# EAGLE design uart_pc (EAGLE 8.3.0)

## Sheet 1 of 4
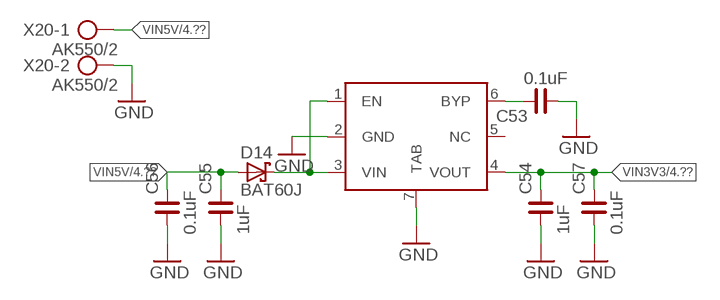
[diagram p0: schematic, sheet 1]

### Parts
C53  0.1uF  C_0603  [C0603]
C54  1uF  C_0603  [C0603]
C55  1uF  C_0603  [C0603]
C56  0.1uF  C_0603  [C0603]
C57  0.1uF  C_0603  [C0603]
D14  BAT60J  [SOD323_ST]
U$3  MIC5353-3.3YMT-TR  [DFN-6_DC-L]
X20  AK550/2  [AK550/2]

### Nets
GND: C53.1 C54.1 C55.1 C56.1 C57.1 U$3.2(GND) U$3.7(TAB) X20.2 ; also sheet 2,3,4
N$47: D14.C U$3.1(EN) U$3.3(VIN)
N$51: C53.2 U$3.6(BYP)
VIN3V3: C54.2 C57.2 U$3.4(VOUT) ; also sheet 4
VIN5V: C55.2 C56.2 D14.A X20.1 ; also sheet 4
Unconnected: U$3.5(NC)

## Sheet 2 of 4
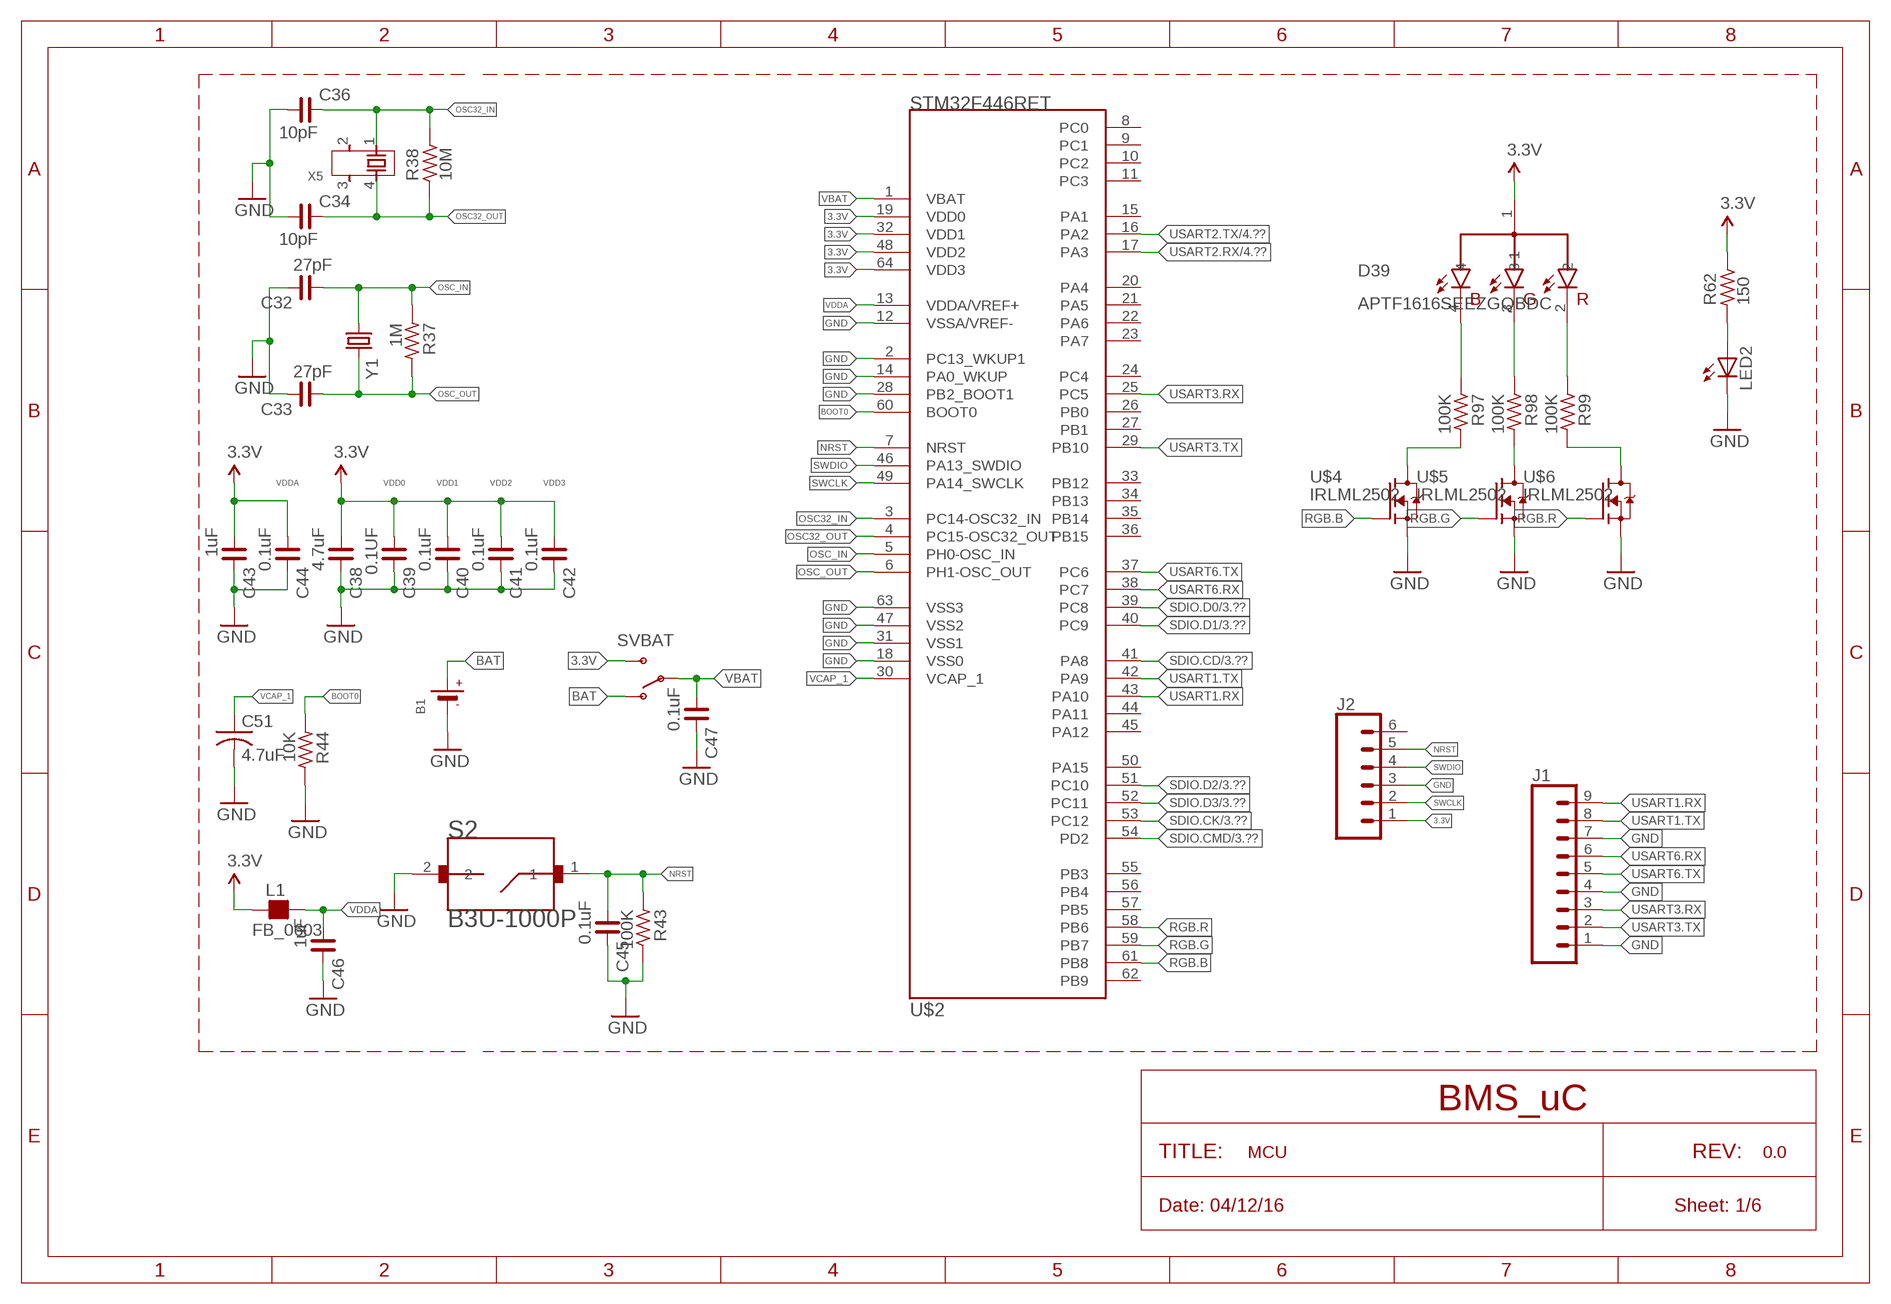
[diagram p1: schematic, sheet 2]

### Parts
B1  BATTERYCR1220_SMT  [CR1220]
C32  27pF  C_0603  [C0603]
C33  27pF  C_0603  [C0603]
C34  10pF  C_0603  [C0603]
C36  10pF  C_0603  [C0603]
C38  4.7uF  C_0603  [C0603]
C39  0.1UF  C_0603  [C0603]
C40  0.1uF  C_0603  [C0603]
C41  0.1uF  C_0603  [C0603]
C42  0.1uF  C_0603  [C0603]
C43  1uF  C_0603  [C0603]
C44  0.1uF  C_0603  [C0603]
C45  0.1uF  C_0603  [C0603]
C46  1uF  C_0603  [C0603]
C47  0.1uF  C_0603  [C0603]
C51  4.7uF  C-USC1206  [C1206]
D39  APTF1616SEEZGQBDC  [0606(1616)]
J1  CONN_09  [1X09]
J2  CONN_06SILK_FEMALE_PTH  [1X06]
L1  FB_0603  [L0603]
LED2  LEDCHIP-LED0603  [CHIP-LED0603]
R37  1M  R_0603  [R0603]
R38  10M  R_0603  [R0603]
R43  100K  R_0603  [R0603]
R44  10K  R_0603  [R0603]
R62  150  R_0603  [R0603]
R97  100K  R_0603  [R0603]
R98  100K  R_0603  [R0603]
R99  100K  R_0603  [R0603]
S2  B3U-1000P  [SW_B3U-1000P]
SVBAT  SWITCH-SPDTSMD  [AYZ0202]
U$2  STM32F446RET  [LQFP64]
U$4  IRLML2502  [SOT23]
U$5  IRLML2502  [SOT23]
U$6  IRLML2502  [SOT23]
X5  CRYSTAL-4PIN  [ABRACON-ABS25-32.768KHZ]
Y1  CRYSTALSMD  [HC49UP]

### Nets
3.3V: C38.1 C39.1 C40.1 C41.1 C42.1 C43.1 C44.1 D39.1 J2.1 L1.1 R62.2 SVBAT.3(S) U$2.19(VDD0) U$2.32(VDD1) U$2.48(VDD2) U$2.64(VDD3) ; also sheet 3,4
BAT: B1.+$1(+) SVBAT.1(O)
BOOT0: R44.1 U$2.60(BOOT0)
GND: B1.- C32.2 C33.2 C34.1 C36.1 C38.2 C39.2 C40.2 C41.2 C42.2 C43.2 C44.2 C45.2 C46.2 C47.2 C51.2 J1.1 J1.4 J1.7 J2.3 LED2.C R43.2 R44.2 S2.2 U$2.2(PC13_WKUP1) U$2.12(VSSA/VREF-) U$2.14(PA0_WKUP) U$2.18(VSS0) U$2.28(PB2_BOOT1) U$2.31(VSS1) U$2.47(VSS2) U$2.63(VSS3) U$4.2(S) U$5.2(S) U$6.2(S) ; also sheet 1,3,4
N$11: D39.3 R98.1
N$12: D39.2 R99.1
N$49: LED2.A R62.1
N$108: D39.4 R97.1
N$117: R97.2 U$4.3(D)
N$122: R98.2 U$5.3(D)
N$126: R99.2 U$6.3(D)
NRST: C45.1 J2.5 R43.1 S2.1 U$2.7(NRST)
OSC32_IN: C36.2 R38.2 U$2.3(PC14-OSC32_IN) X5.1
OSC32_OUT: C34.2 R38.1 U$2.4(PC15-OSC32_OUT) X5.4
OSC_IN: C32.1 R37.1 U$2.5(PH0-OSC_IN) Y1.1
OSC_OUT: C33.1 R37.2 U$2.6(PH1-OSC_OUT) Y1.2
RGB.B: U$2.61(PB8) U$4.1(G)
RGB.G: U$2.59(PB7) U$5.1(G)
RGB.R: U$2.58(PB6) U$6.1(G)
SDIO.CD: U$2.41(PA8) ; also sheet 3
SDIO.CK: U$2.53(PC12) ; also sheet 3
SDIO.CMD: U$2.54(PD2) ; also sheet 3
SDIO.D0: U$2.39(PC8) ; also sheet 3
SDIO.D1: U$2.40(PC9) ; also sheet 3
SDIO.D2: U$2.51(PC10) ; also sheet 3
SDIO.D3: U$2.52(PC11) ; also sheet 3
SWCLK: J2.2 U$2.49(PA14_SWCLK)
SWDIO: J2.4 U$2.46(PA13_SWDIO)
USART1.RX: J1.9 U$2.43(PA10)
USART1.TX: J1.8 U$2.42(PA9)
USART2.RX: U$2.17(PA3) ; also sheet 4
USART2.TX: U$2.16(PA2) ; also sheet 4
USART3.RX: J1.3 U$2.25(PC5)
USART3.TX: J1.2 U$2.29(PB10)
USART6.RX: J1.6 U$2.38(PC7)
USART6.TX: J1.5 U$2.37(PC6)
VBAT: C47.1 SVBAT.2(P) U$2.1(VBAT)
VCAP_1: C51.1 U$2.30(VCAP_1)
VDDA: C46.1 L1.2 U$2.13(VDDA/VREF+)
Unconnected: J2.6 U$2.8(PC0) U$2.9(PC1) U$2.10(PC2) U$2.11(PC3) U$2.15(PA1) U$2.20(PA4) U$2.21(PA5) U$2.22(PA6) U$2.23(PA7) U$2.24(PC4) U$2.26(PB0) U$2.27(PB1) U$2.33(PB12) U$2.34(PB13) U$2.35(PB14) U$2.36(PB15) U$2.44(PA11) U$2.45(PA12) U$2.50(PA15) U$2.55(PB3) U$2.56(PB4) U$2.57(PB5) U$2.62(PB9) X5.2 X5.3

### Notes on the sheet
- VDDA | VDD0 | VDD1 | VDD2 | VDD3
- BMS_uC
- TITLE: | MCU | REV: | 0.0
- Date: 04/12/16 | Sheet: 1/6

## Sheet 3 of 4
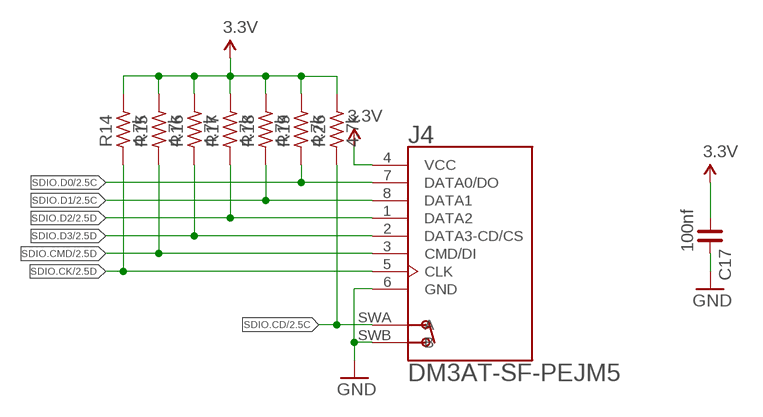
[diagram p2: schematic, sheet 3]

### Parts
C17  100nf  C_0603  [C0603]
J4  DM3AT-SF-PEJM5  [HRS_DM3AT-SF-PEJM5]
R14  4.7k  R_0603  [R0603]
R15  4.7k  R_0603  [R0603]
R16  4.7k  R_0603  [R0603]
R17  4.7k  R_0603  [R0603]
R18  4.7k  R_0603  [R0603]
R19  4.7k  R_0603  [R0603]
R26  4.7k  R_0603  [R0603]

### Nets
3.3V: C17.1 J4.4(VCC) R14.2 R15.2 R16.2 R17.2 R18.2 R19.2 R26.2 ; also sheet 2,4
GND: C17.2 J4.6(GND) J4.SWB(B) ; also sheet 1,2,4
SDIO.CD: J4.SWA(A) R26.1 ; also sheet 2
SDIO.CK: J4.5(CLK) R14.1 ; also sheet 2
SDIO.CMD: J4.3(CMD/DI) R15.1 ; also sheet 2
SDIO.D0: J4.7(DATA0/DO) R19.1 ; also sheet 2
SDIO.D1: J4.8(DATA1) R18.1 ; also sheet 2
SDIO.D2: J4.1(DATA2) R17.1 ; also sheet 2
SDIO.D3: J4.2(DATA3-CD/CS) R16.1 ; also sheet 2

## Sheet 4 of 4
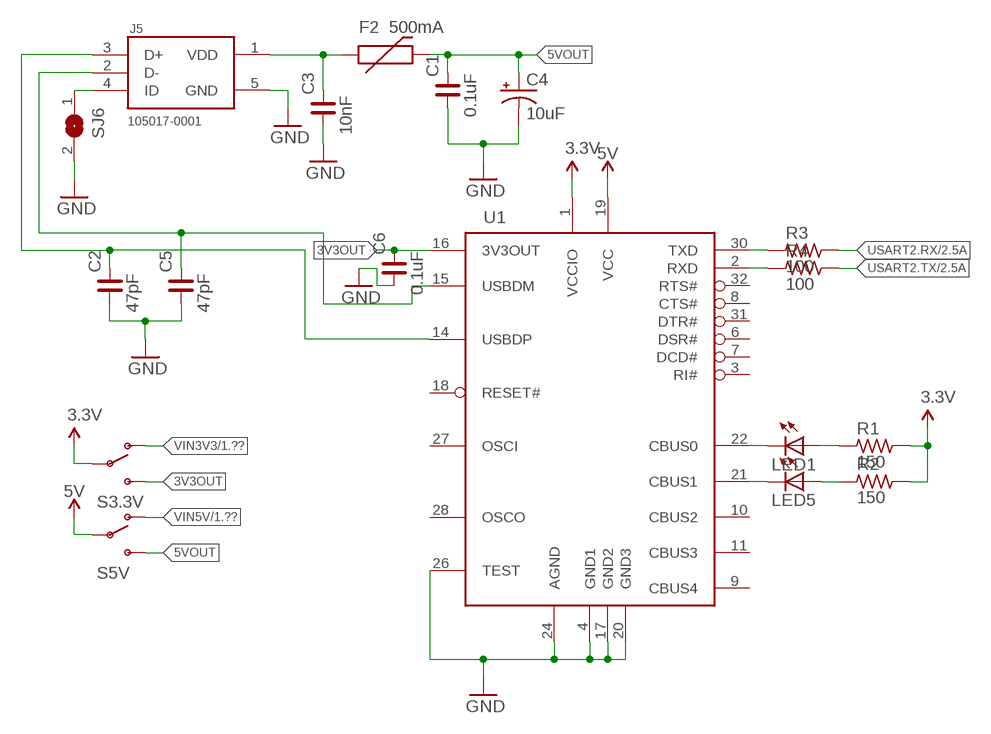
[diagram p3: schematic, sheet 4]

### Parts
C1  0.1uF  C_0603  [C0603]
C2  47pF  C_0603  [C0603]
C3  10nF  C_0603  [C0603]
C4  10uF  10UF-16V-10%(TANT)  [EIA3216]
C5  47pF  C_0603  [C0603]
C6  0.1uF  C_0603  [C0603]
F2  500mA  PTCSMD  [PTC-1206]
J5  105017-0001  [MOLEX_105017-0001]
LED1  LEDCHIPLED_0603  [CHIPLED_0603]
LED5  LEDCHIPLED_0603  [CHIPLED_0603]
R1  150  R_0603  [R0603]
R2  150  R_0603  [R0603]
R3  100  R_0603  [R0603]
R4  100  R_0603  [R0603]
S3.3V  SWITCH-SPDTSMD  [AYZ0202]
S5V  SWITCH-SPDTSMD  [AYZ0202]
SJ6  SOLDERJUMPER  [SOLDERJUMPER_ARROW_NOPASTE]
U1  FT232RQ  [LQFP32]

### Nets
3.3V: R1.2 R2.2 S3.3V.2(P) U1.1(VCCIO) ; also sheet 2,3
3V3OUT: C6.2 S3.3V.3(S) U1.16(3V3OUT)
5V: S5V.2(P) U1.19(VCC)
5VOUT: C1.2 C4.A(+) F2.2 S5V.3(S)
GND: C1.1 C2.1 C3.1 C4.C(-) C5.1 C6.1 J5.5(GND) SJ6.2 U1.4(GND1) U1.17(GND2) U1.20(GND3) U1.24(AGND) U1.26(TEST) ; also sheet 1,2,3
N$1: C5.2 J5.2(D-) U1.15(USBDM)
N$2: C2.2 J5.3(D+) U1.14(USBDP)
N$3: C3.2 F2.1 J5.1(VDD)
N$4: J5.4(ID) SJ6.1
N$5: LED1.C U1.22(CBUS0)
N$6: LED5.C U1.21(CBUS1)
N$7: LED1.A R1.1
N$8: LED5.A R2.1
N$9: R3.1 U1.30(TXD)
N$10: R4.1 U1.2(RXD)
USART2.RX: R3.2 ; also sheet 2
USART2.TX: R4.2 ; also sheet 2
VIN3V3: S3.3V.1(O) ; also sheet 1
VIN5V: S5V.1(O) ; also sheet 1
Unconnected: U1.3(RI#) U1.6(DSR#) U1.7(DCD#) U1.8(CTS#) U1.9(CBUS4) U1.10(CBUS2) U1.11(CBUS3) U1.18(RESET#) U1.27(OSCI) U1.28(OSCO) U1.31(DTR#) U1.32(RTS#)

## Library data of the parts
B1 = microbuilder:BATTERY: CR1220 SMT - Digikey: 3001K-ND CD2032 BAT-HLD-001 - Digikey: BAT-HLD-001-ND
C1-C3 C5 C6 C17 C32-C34 C36 C38-C47 C53-C57 = rc-master-smd:C_: NON-POLARIZED CAP
C4 = SparkFun-Capacitors:10UF-16V-10%(TANT): CAP-00811 1206/EIA-3216 Tantalum capacitor; PROD_ID: CAP-00811
C51 = rcl:C-US: CAPACITOR, American symbol
D14 = diode:BAT60J: Schottky barrier diode Source: www.st.com, BAT60J.pdf
D39 = Kingbright:APTF1616SEEZGQBDC: Red/Green/Blue 0404 120° Water Clear 30/40/20 mcd PCB Surface Mount LED; AVAILABILITY: Good; DESCRIPTION: Red/Green/Blue 0404 120%C2%B0 Water Clear 30/40/20 mcd PCB Surface Mount LED; MF: Lumex; MP: SML-LX0404SIUPGUSB; PACKAGE: 0404 Lumex; PRICE: 0.57 USD
F2 = SparkFun:PTC: Resettable Fuse PTC Resettable Fuse. Spark Fun Electronics SKU : COM-08357
J1 = SparkFun-Connectors:CONN_09: Multi connection point. Often used as Generic Header-pin footprint for 0.1 inch spaced/style header connections On any of the 0.1 inch spaced packages, you can populate with these: Break Away Headers - Straight <https://www.sparkfun.com/products/116> (PRT-00116) Break Away Male Headers - Right Angle <https://www.sparkfun.com/products/553> (PRT-00553) Female Headers <https://www.sparkfun.com/products/115> (PRT-00115) Break Away Headers - Machine Pin <https://www.sparkfun.com/products/117> (PRT-00117) Break Away Female Headers - Swiss Machine Pin <https://www.sparkfun.com/products/743> (PRT-00743) For SCREWTERMINALS and SPRING TERMINALS visit here: Screw Terimnals on SparkFun.com <https://www.sparkfun.com/search/results?term=Screw+Terminals> (5mm/3.5mm/2.54mm spacing) This device is also useful as a general connection point to wire up your design to another part of your project. Our various solder wires solder well into these plated through hole pads. Hook-Up Wire - Assortment (Stranded, 22 AWG) <https://www.sparkfun.com/products/11375> (PRT-11375) Hook-Up Wire - Assortment (Solid Core, 22 AWG) <https://www.sparkfun.com/products/11367> (PRT-11367) View the entire wire category on our website here <https://www.sparkfun.com/categories/141> Special notes: Molex polarized connector foot print use with SKU : PRT-08231 with associated crimp pins and housings. 1MM SMD Version SKU: PRT-10208 NOTES ON THE VARIANTS LOCK and LOCK_LONGPADS... This footprint was designed to help hold the alignment of a through-hole component (i.e. 6-pin header) while soldering it into place. You may notice that each hole has been shifted either up or down by 0.005 of an inch from it's more standard position (which is a perfectly straight line). This slight alteration caused the pins (the squares in the middle) to touch the edges of the holes. Because they are alternating, it causes a "brace" to hold the component in place. 0.005 has proven to be the perfect amount of "off-center" position when using our standard breakaway headers. Although looks a little odd when you look at the bare footprint, once you have a header in there, the alteration is very hard to notice. Also,if you push a header all the way into place, it is covered up entirely on the bottom side.
J2 = SparkFun-Connectors:CONN_06: Multi connection point. Often used as Generic Header-pin footprint for 0.1 inch spaced/style header connections On any of the 0.1 inch spaced packages, you can populate with these: Break Away Headers - Straight <https://www.sparkfun.com/products/116> (PRT-00116) Break Away Male Headers - Right Angle <https://www.sparkfun.com/products/553> (PRT-00553) Female Headers <https://www.sparkfun.com/products/115> (PRT-00115) Break Away Headers - Machine Pin <https://www.sparkfun.com/products/117> (PRT-00117) Break Away Female Headers - Swiss Machine Pin <https://www.sparkfun.com/products/743> (PRT-00743) Arduino Stackable Header - 6 Pin <https://www.sparkfun.com/products/9280> (PRT-09280) For SCREWTERMINALS and SPRING TERMINALS visit here: Screw Terimnals on SparkFun.com <https://www.sparkfun.com/search/results?term=Screw+Terminals> (5mm/3.5mm/2.54mm spacing) This device is also useful as a general connection point to wire up your design to another part of your project. Our various solder wires solder well into these plated through hole pads. Hook-Up Wire - Assortment (Stranded, 22 AWG) <https://www.sparkfun.com/products/11375> (PRT-11375) Hook-Up Wire - Assortment (Solid Core, 22 AWG) <https://www.sparkfun.com/products/11367> (PRT-11367) View the entire wire category on our website here <https://www.sparkfun.com/categories/141>; PROD_ID: CONN-08437
J4 = DM3AT-SF-PEJM5:DM3AT-SF-PEJM5: DM3 Series 8 Position Right Angle SMT Push Push Ejection MicroSD Card Connector; AVAILABILITY: Good; DESCRIPTION: DM3 Series 8 Position Right Angle SMT Push Push Ejection MicroSD Card Connector; MF: Hirose; MP: DM3AT-SF-PEJM5; PACKAGE: None; PRICE: 1.95 USD
J5 = Molex_105017-0001:105017-0001; AVAILABILITY: Good; DESCRIPTION: Conn USB Type B M 5 POS 0.65mm Solder RA Thru-Hole 5 Terminal 1 Port Embossed T/R; MF: Molex; MP: 105017-0001; PACKAGE: None; PRICE: 0.52 USD
L1 = rc-master-smd:FB_: FERRITE BEAD
LED1 LED2 LED5 = adafruit:LED: LED OSRAM: - CHIPLED LG R971, LG N971, LY N971, LG Q971, LY Q971, LO R971, LY R971 LH N974, LH R974 LS Q976, LO Q976, LY Q976 LO Q996 - Hyper CHIPLED LW Q18S LB Q993, LB Q99A, LB R99A - SideLED LS A670, LO A670, LY A670, LG A670, LP A670 LB A673, LV A673, LT A673, LW A673 LH A674 LY A675 LS A676, LA A676, LO A676, LY A676, LW A676 LS A679, LY A679, LG A679 - Hyper Micro SIDELED® LS Y876, LA Y876, LO Y876, LY Y876 LT Y87S - SmartLED LW L88C, LW L88S LB L89C, LB L89S, LG L890 LS L89K, LO L89K, LY L89K LS L896, LA L896, LO L896, LY L896 - TOPLED LS T670, LO T670, LY T670, LG T670, LP T670 LSG T670, LSP T670, LSY T670, LOP T670, LYG T670 LG T671, LOG T671, LSG T671 LB T673, LV T673, LT T673, LW T673 LH T674 LS T676, LA T676, LO T676, LY T676, LB T676, LH T676, LSB T676, LW T676 LB T67C, LV T67C, LT T67C, LS T67K, LO T67K, LY T67K, LW E67C LS E67B, LA E67B, LO E67B, LY E67B, LB E67C, LV E67C, LT E67C LW T67C LS T679, LY T679, LG T679 LS T770, LO T770, LY T770, LG T770, LP T770 LB T773, LV T773, LT T773, LW T773 LH T774 LS E675, LA E675, LY E675, LS T675 LS T776, LA T776, LO T776, LY T776, LB T776 LHGB T686 LT T68C, LB T68C - Hyper Mini TOPLED® LB M676 - Mini TOPLED Santana® LG M470 LS M47K, LO M47K, LY M47K Source: http://www.osram.convergy.de/
R1-R4 R14-R19 R26 R37 R38 R43 R44 R62 R97-R99 = rc-master-smd:R_: RESISTOR
S2 = B3U-1000P:B3U-1000P: Switch Tactile N.O. SPST Round Button Gull Wing 0.05A 12VDC 1.5N SMD Embossed T/R; AVAILABILITY: Good; DESCRIPTION: Switch Tactile N.O. SPST Round Button Gull Wing 0.05A 12VDC 1.5N SMD Embossed T/R; MF: Omron; MP: B3U-1000P; PACKAGE: None; PRICE: 0.72 USD
S3.3V S5V SVBAT = SparkFun-Electromechanical:SWITCH-SPDT: SPDT Switch Simple slide switch, Spark Fun Electronics SKU : COM-00102 DPDT SMT slide switch, AYZ0202, SWCH-08179; PROD_ID: SWCH-08179
SJ6 = microbuilder:SOLDERJUMPER: SMD Solder JUMPER Solder the two pads together to create a connection, or remove the solder to break it. REFLOW - Use this footprint for solder paste and reflow ovens. WAVE - Use this footprint for hand-soldering (larger pads). CLOSED - Has a trace between the two pads to ensure it is closed by default. The trace needs to be cut to disable the jumper, and can be closed again by creating a solder bridge between the two pads.; BOM: EXCLUDE
U1 = FT232RQ:FT232RQ: USB UART 4th Generation USB UART (USB <-> Serial) Controller; AVAILABILITY: Good; DESCRIPTION: USB-to-UART 1-CH 256Byte FIFO 5V 32-Pin QFN EP; MF: FTDI; MP: FT232RQ; PACKAGE: None; PRICE: 6.56 USD
U$2 = pel_stm32:STM32F446RET
U$3 = DFN-6_DC-L:MIC5353-3.3YMT-TR
U$4-U$6 = IRLML2502:IRLML2502; AVAILABILITY: Unavailable; MF: International Rectifier; MP: IRLML2502; PACKAGE: SOT-23-3 International Rectifier; PRICE: 0.17 USD
X5 = FaBo-Crystal:CRYSTAL-4PIN
X20 = con-ptr500:AK550/2: CONNECTOR; OC_FARNELL: unknown; OC_NEWARK: unknown
Y1 = SparkFun-FreqCtrl:CRYSTAL: Various standard crystals. Proven footprints.

## Net classes
0 default: width 0.203 mm

## Board
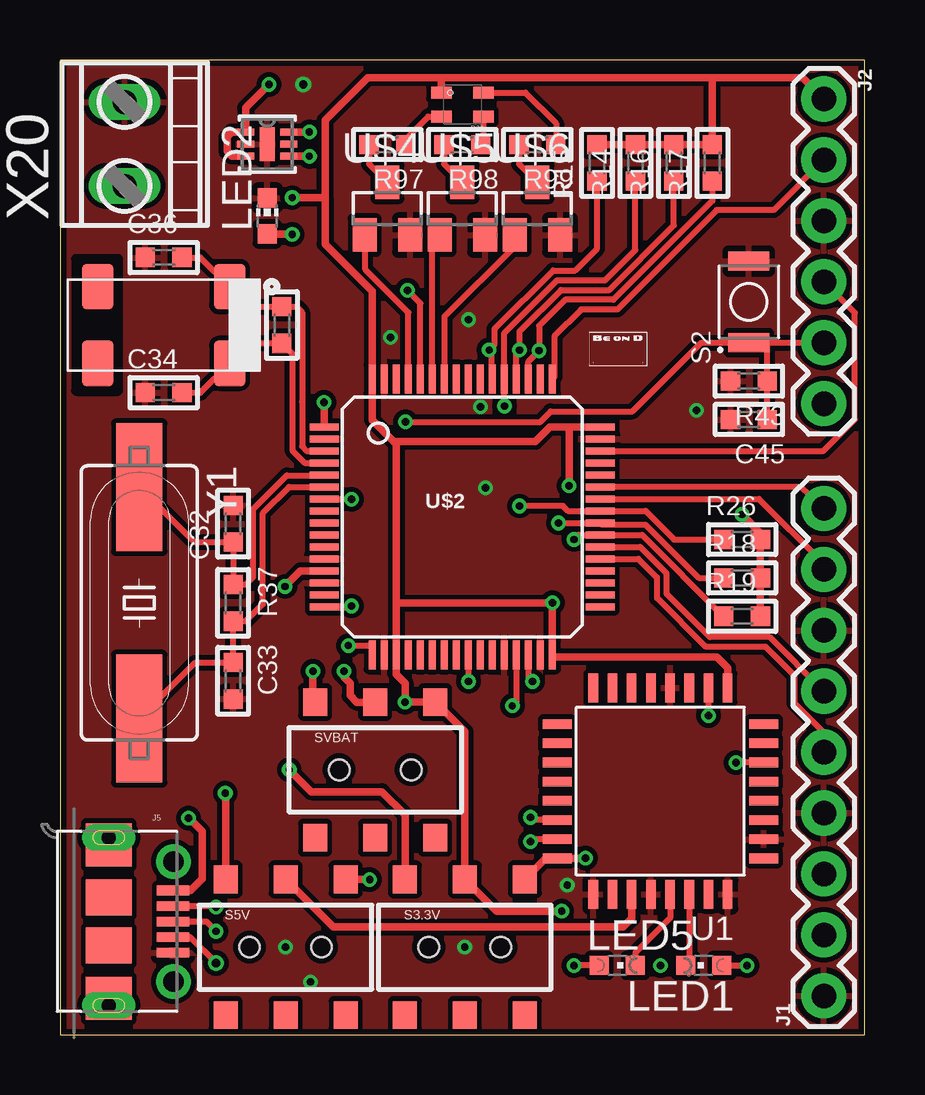
[diagram p4: board, top side]
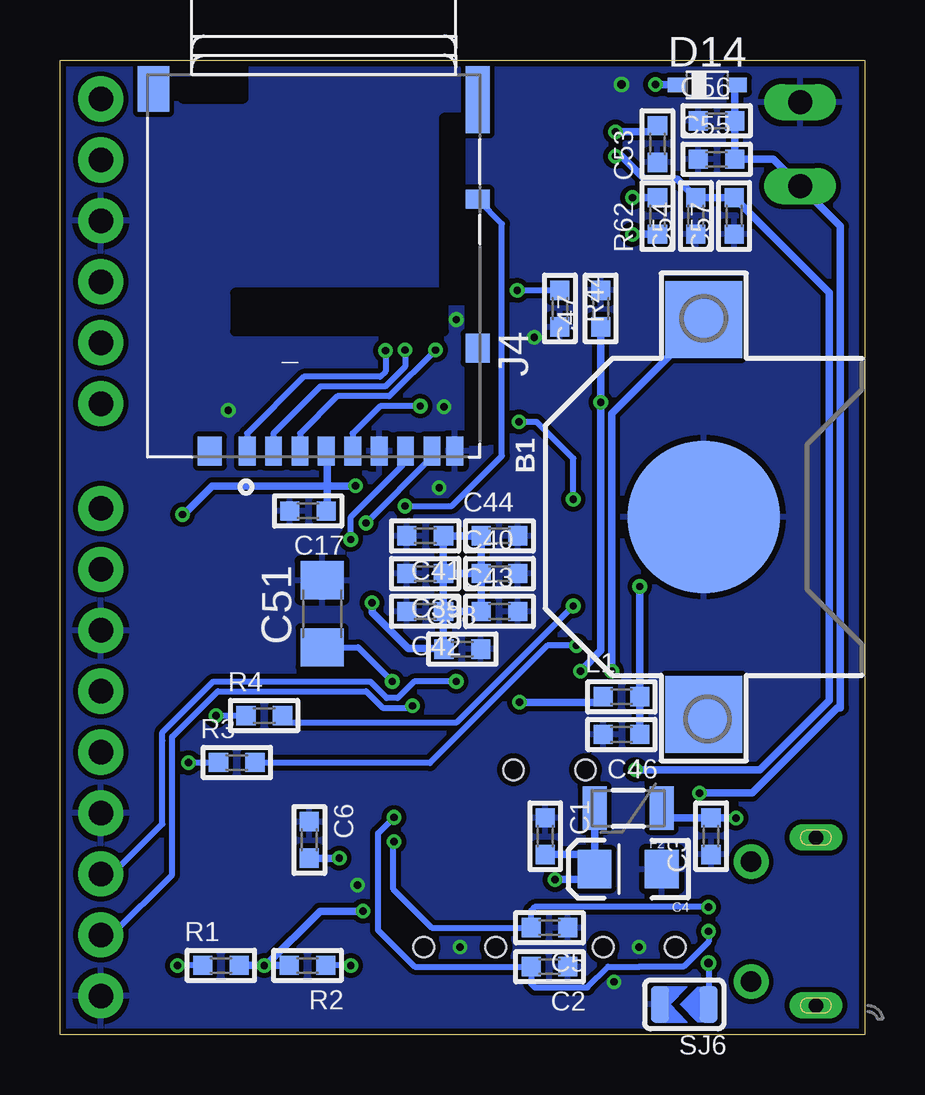
[diagram p5: board, bottom side, seen from below]

Size 33.53 x 40.64 mm. Coordinates in mm from the lower left corner, seen from the top.
Outline: 0,0 33.53,0 33.53,40.64 0,40.64 0,0
Copper layers (1*16): Top 0.035mm / dielectric 1.5mm / Bottom 0.035mm
Design rules "SeeedStudio_2layer_DRU_no_angle_20140221": minimum track width 6mil, minimum drill 12mil, track to track 6mil, track to pad 6mil, pad to pad 6mil, via to via 6mil, smd to smd 0mil, copper to edge 10mil, drill to drill 10mil, minimum pad ring 10mil, minimum via ring 6mil, stop-mask expansion 2mil, vias tented up to drill 100mil, thermal gap 10mil

### Footprints (pad centres in the part's own frame; a part is rotated, then mirrored left to right if it is on the bottom)
CR1220 = smd 3.2 x 3.2: +$1 -8.225,0; +$2 8.225,0 | smd 6.35 x 6.35: - 0,0
C0603 = smd 0.8 x 0.8: 1 -0.762,0; 2 0.762,0
EIA3216 = smd 1.4 x 1.6: A 1.4,0; C -1.4,0
C1206 = smd 1.6 x 1.8: 1 -1.4,0; 2 1.4,0
SOD323_ST = smd 0.8 x 0.6: A 1.25,0; C -1.25,0
0606(1616) = smd 0.85 x 0.5: 1 0.875,-0.5; 2 -0.875,-0.5; 3 -0.875,0.5; 4 0.875,0.5
PTC-1206 = smd 1 x 1.8: 1 -1.4,0; 2 1.4,0
1X09 = drill 1.016 pad 1.88: 1 0,0; 2 2.54,0; 3 5.08,0; 4 7.62,0; 5 10.16,0; 6 12.7,0; 7 15.24,0; 8 17.78,0; 9 20.32,0
1X06 = drill 1.016 pad 1.88: 1 0,0; 2 2.54,0; 3 5.08,0; 4 7.62,0; 5 10.16,0; 6 12.7,0
HRS_DM3AT-SF-PEJM5 = smd 0.7 x 1.2: 1 3.2,0; 2 2.1,0; 3 1,0; 4 -0.1,0; 5 -1.2,0; 6 -2.3,0; 7 -3.4,0; 8 -4.5,0; SWB -5.45,0 | smd 1 x 1.2: P1 -6.4,-4.3; P4 4.75,0 | smd 1 x 2.8: P2 -6.4,-14.65 | smd 1.3 x 1.9: P3 7.1,-15.1 | smd 1 x 0.8: SWA -6.4,-10.5
MOLEX_105017-0001 = smd 0.4 x 1.35: 1 -1.3,2.675; 2 -0.65,2.675; 3 0,2.675; 4 0.65,2.675; 5 1.3,2.675 | drill 0.85 pad 1.45: P$1 -2.5,2.7; P$2 2.5,2.7 | smd 1.5 x 1.9: P$8 -1,0; P$9 1,0 | smd 1.8 x 1.9: P$10 -3.2,0; P$11 3.2,0 | drill 0.6 pad 0.8 long: P$12 -3.5,0; P$13 3.5,0
L0603 = smd 0.8 x 0.8: 1 -0.762,0; 2 0.762,0
CHIPLED_0603 = smd 0.8 x 0.8: A 0,-0.75; C 0,0.75
CHIP-LED0603 = smd 0.8 x 0.8: A 0,-0.75; C 0,0.75
R0603 = smd 0.8 x 0.8: 1 -0.762,0; 2 0.762,0
SW_B3U-1000P = smd 0.8 x 1.7: 1 -1.7,0; 2 1.7,0
AYZ0202 = smd 1 x 1.15: 1 -2.5,2.825; 2 0,2.825; 3 2.5,2.825; 4 -2.5,-2.825; 5 0,-2.825; 6 2.5,-2.825 | hole 0.85: 1.5,0; -1.5,0
SOLDERJUMPER_ARROW_NOPASTE = smd 0.762 x 1.524: 1 -1.016,0; 2 1.016,0
LQFP32 = smd 0.4 x 1.2: 1 -2.8,-4.3; 2 -2,-4.3; 3 -1.2,-4.3; 4 -0.4,-4.3; 5 0.4,-4.3; 6 1.2,-4.3; 7 2,-4.3; 8 2.8,-4.3; 17 2.8,4.3; 18 2,4.3; 19 1.2,4.3; 20 0.4,4.3; 21 -0.4,4.3; 22 -1.2,4.3; 23 -2,4.3; 24 -2.8,4.3 | smd 1.2 x 0.4: 9 4.3,-2.8; 10 4.3,-2; 11 4.3,-1.2; 12 4.3,-0.4; 13 4.3,0.4; 14 4.3,1.2; 15 4.3,2; 16 4.3,2.8; 25 -4.3,2.8; 26 -4.3,2; 27 -4.3,1.2; 28 -4.3,0.4; 29 -4.3,-0.4; 30 -4.3,-1.2; 31 -4.3,-2; 32 -4.3,-2.8
LQFP64 = smd 1.2 x 0.3: 1 -5.75,3.75; 2 -5.75,3.25; 3 -5.75,2.75; 4 -5.75,2.25; 5 -5.75,1.75; 6 -5.75,1.25; 7 -5.75,0.75; 8 -5.75,0.25; 9 -5.75,-0.25; 10 -5.75,-0.75; 11 -5.75,-1.25; 12 -5.75,-1.75; 13 -5.75,-2.25; 14 -5.75,-2.75; 15 -5.75,-3.25; 16 -5.75,-3.75; 33 5.75,-3.75; 34 5.75,-3.25; 35 5.75,-2.75; 36 5.75,-2.25; 37 5.75,-1.75; 38 5.75,-1.25; 39 5.75,-0.75; 40 5.75,-0.25; 41 5.75,0.25; 42 5.75,0.75; 43 5.75,1.25; 44 5.75,1.75; 45 5.75,2.25; 46 5.75,2.75; 47 5.75,3.25; 48 5.75,3.75 | smd 0.3 x 1.2: 17 -3.75,-5.75; 18 -3.25,-5.75; 19 -2.75,-5.75; 20 -2.25,-5.75; 21 -1.75,-5.75; 22 -1.25,-5.75; 23 -0.75,-5.75; 24 -0.25,-5.75; 25 0.25,-5.75; 26 0.75,-5.75; 27 1.25,-5.75; 28 1.75,-5.75; 29 2.25,-5.75; 30 2.75,-5.75; 31 3.25,-5.75; 32 3.75,-5.75; 49 3.75,5.75; 50 3.25,5.75; 51 2.75,5.75; 52 2.25,5.75; 53 1.75,5.75; 54 1.25,5.75; 55 0.75,5.75; 56 0.25,5.75; 57 -0.25,5.75; 58 -0.75,5.75; 59 -1.25,5.75; 60 -1.75,5.75; 61 -2.25,5.75; 62 -2.75,5.75; 63 -3.25,5.75; 64 -3.75,5.75
DFN-6_DC-L = smd 0.703 x 0.3: 1 -0.902,0.5; 2 -0.902,0; 3 -0.902,-0.5; 4 0.902,-0.5; 5 0.902,0; 6 0.902,0.5 | smd 0.61 x 1.42: 7 0,0
SOT23 = smd 1 x 1.4: 1 -0.95,-1.1; 2 0.95,-1.1; 3 0,1.1
ABRACON-ABS25-32.768KHZ = smd 1.3 x 1.9: 1 -2.75,-1.6; 2 2.75,-1.6; 3 2.75,1.6; 4 -2.75,1.6
AK550/2 = drill 1 pad 1.5 long: 1 -1.75,0; 2 1.75,0
HC49UP = smd 5.334 x 1.93: 1 -4.826,0; 2 4.826,0

### Placement (x,y rotation side)
B1  6.71,21.59 270 bottom
C1  13.31,8.28 270 bottom
C2  13.13,2.84 180 bottom
C3  6.4,8.28 90 bottom
C4  9.86,6.91 180 bottom
C5  13.13,4.47 180 bottom
C6  23.14,8.13 270 bottom
C17  23.19,21.84 180 bottom
C32  7.21,21.31 90 top
C33  7.21,14.76 270 top
C34  4.32,26.77 0 top
C36  4.32,32.41 0 top
C38  16.76,16.08 0 bottom
C39  18.31,19.23 180 bottom
C40  15.21,19.23 0 bottom
C41  18.31,20.8 180 bottom
C42  18.31,17.65 180 bottom
C43  15.21,17.65 0 bottom
C44  15.21,20.8 0 bottom
C45  28.7,25.65 180 top
C46  10.13,12.52 180 bottom
C47  11,30.28 90 bottom
C51  22.61,17.55 90 bottom
C53  8.64,37.13 90 bottom
C54  7.04,34.14 90 bottom
C55  6.17,36.5 0 bottom
C56  6.17,38.1 0 bottom
C57  5.44,34.14 90 bottom
D14  6.55,39.6 0 bottom
D39  16.76,38.79 180 top
F2  9.86,9.45 180 bottom
J1  31.83,1.63 90 top
J2  31.83,39.01 270 top
J4  22.53,24.33 180 bottom
J5  2.03,4.72 270 top
L1  10.13,14.1 0 bottom
LED1  26.82,2.9 90 top
LED2  8.64,34.14 0 top
LED5  23.22,2.9 270 top
R1  26.82,2.9 0 bottom
R2  23.22,2.9 180 bottom
R3  26.16,11.35 0 bottom
R4  25.02,13.31 0 bottom
R14  23.98,36.35 90 top
R15  22.38,36.35 90 top
R16  25.58,36.35 90 top
R17  27.18,36.35 90 top
R18  28.42,19.05 0 top
R19  28.42,17.45 0 top
R26  28.42,20.65 0 top
R37  7.21,18.01 270 top
R38  9.25,29.59 90 top
R43  28.7,27.25 180 top
R44  12.7,30.28 270 bottom
R62  8.64,34.14 90 bottom
R97  13.64,37.11 180 top
R98  16.76,37.11 180 top
R99  19.89,37.11 180 top
S2  28.7,30.56 90 top
S3.3V  16.87,3.66 0 top
S5V  9.4,3.66 0 top
SJ6  7.52,1.27 180 bottom
SVBAT  13.13,11.05 0 top
U1  25.02,10.16 180 top
U$2  16.76,21.59 0 top
U$3  8.64,37.13 0 top
U$4  13.64,34.44 0 top
U$5  16.76,34.44 0 top
U$6  19.89,34.44 0 top
X5  4.32,29.59 180 top
X20  2.69,37.13 90 top
Y1  3.3,18.01 270 top

### Tracks (layer width: path | path; a pad name or v marks a point on that pad's centre or on a via)
3.3V  (via drill 0.3 pad 0.61)
  Top 0.305: 14.01,17.96 14.01,24.63 13.91,24.73 | 14.01,17.96 U$2.19 14.01,15.02 14.38,14.66 v14.38,13.87 SVBAT.3 | 14.01,17.96 14.06,18.01 20.5,18.01 20.51,18 | R15.2 R14.2 R16.2 R17.2 27.18,39.9 | 15.89,39.9 D39.1 | 15.89,39.9 12.83,39.9 11.05,38.12 11.05,34.9 | J2.1 30.94,39.9 27.18,39.9 | 27.18,39.9 15.89,39.9 | 21.27,25.34 U$2.48 | 11.05,34.9 11.05,32.97 13.01,31 U$2.64 13.01,25.63 13.91,24.73 | v9.68,34.9 11.05,34.9 | R19.2 R18.2 R26.2 29.18,20.93 v28.42,21.69 | v21.21,22.89 21.21,25.28 21.27,25.34 | 13.91,24.73 19.81,24.73 20.41,25.34 21.27,25.34 | v20.52,18.01 20.51,18 | 20.51,18 U$2.32 20.61,15.75 27.09,15.75 | SVBAT.3 | SVBAT.3 16.87,12.64 S3.3V.2 18.19,5.16 v20.9,5.16 | 27.09,15.75 | 27.09,15.75 27.37,15.75 27.82,15.3 U1.1
  Bottom 0.305: R62.2 v9.68,34.9 | v28.42,21.69 28.4,21.67 27.18,22.89 22.38,22.89 | v21.21,22.89 22.38,22.89 | J4.4 22.38,24.29 22.38,22.89 | 22.38,22.89 22.38,21.89 C17.1 | 16.02,20.8 17.43,20.8 | 16.02,20.8 C44.1 | 17.43,20.8 C41.1 | 16.04,19.23 C40.1 15.98,20.76 16.02,20.8 | 17.43,19.23 16.04,19.23 | 17.43,19.23 C39.1 17.55,20.68 17.43,20.8 | C42.1 C43.1 15.98,19.16 16.04,19.23 | C42.1 17.55,16.1 | C42.1 17.55,19.11 17.43,19.23 | v20.52,18.01 20.52,17.6 19.02,16.1 17.55,16.1 | 17.55,16.1 C38.1 | v14.38,13.87 11.12,13.87 L1.1 | 24.95,2.9 v25.02,2.9 R1.2 | 24.95,2.9 R2.2 | v20.9,5.16 22.68,5.16 24.95,2.9
3V3OUT  (via drill 0.3 pad 0.61)
  Top 0.305: S3.3V.3 20.24,7.36 U1.16 v21.89,7.36 v21.89,7.37
  Bottom 0.305: v21.89,7.37 C6.2
5V
  Top 0.305: S5V.2 11.38,4.5 23.47,4.5 23.82,4.85 U1.19
5VOUT  (via drill 0.3 pad 0.61)
  Top 0.305: S5V.3 v12.9,6.48
  Bottom 0.305: 11.26,7.1 C4.A 11.69,6.48 v12.9,6.48 | 11.26,7.1 F2.2 | C1.2 11.68,7.52 11.26,7.1
BAT  (via drill 0.3 pad 0.61)
  Top 0.305: SVBAT.1 10.54,13.96 v10.54,15.16
  Bottom 0.305: B1.+$1 6.71,29.74 10.54,25.91 v10.54,15.16
BOOT0  (via drill 0.3 pad 0.61)
  Top 0.254: U$2.60 15.01,30.5 v14.48,31.04
  Bottom 0.254: v14.48,31.04 R44.1
GND  (via drill 0.3 pad 0.61, 0.35)
  other vias: 10.13,39.62 17.53,26.19 17.73,22.81 13.77,29.08 17.02,29.82 26.52,26.04 10.44,2.21 9.4,3.66 16.87,3.66 21.13,6.25
  pour Top (isolate 0.203): -2.54,43.18 35.56,43.18 35.56,-2.54 -2.54,-2.54
  pour Bottom (isolate 0.203): -1.27,41.91 34.29,41.91 34.29,-1.27 -1.27,-1.27
N$1  (via drill 0.3 pad 0.61)
  Top 0.254: U1.15 19.72,8.16 v19.61,8.05 | J5.2 6.46,5.37 v6.5,5.33
  Bottom 0.254: v19.61,8.05 19.63,8.03 19.63,6.07 18.03,4.47 C5.2 13.89,5.18 13.74,5.33 v6.5,5.33
N$2  (via drill 0.3 pad 0.61)
  Top 0.254: U1.14 19.72,8.96 v19.61,9.07 | J5.3 6.1,4.72 v6.5,4.32
  Bottom 0.254: v19.61,9.07 20.27,8.41 20.27,4.37 18.75,2.85 C2.2 13.89,2.13 13.74,1.98 11.56,1.98 10.69,2.85 9.37,2.85 7.56,2.85 7.55,2.86 7.52,2.86 6.5,3.89 v6.5,4.32
N$3  (via drill 0.3 pad 0.61)
  Top 0.305: J5.1 5.44,6.02 5.92,6.5 5.92,8.48 v5.36,9.04
  Bottom 0.305: F2.1 8.05,9.04 C3.2 v5.36,9.04
N$4  (via drill 0.35)
  Top 0.254: J5.4 5.42,4.07 v6.5,3
  Bottom 0.254: v6.5,3 SJ6.1
N$5
  Top 0.254: U1.22 26.22,3.04 LED1.C
N$6
  Top 0.254: U1.21 25.42,4.87 23.98,3.43 LED5.C
N$7  (via drill 0.3 pad 0.61)
  Top 0.254: LED1.A v28.63,2.9
  Bottom 0.254: 27.61,2.92 R1.1 v28.63,2.9
N$8  (via drill 0.3 pad 0.61)
  Top 0.254: LED5.A v21.41,2.9
  Bottom 0.254: v21.41,2.9 R2.1
N$9  (via drill 0.3 pad 0.61)
  Top 0.254: U1.30 v28.18,11.36 v28.17,11.35
  Bottom 0.254: v28.17,11.35 R3.1
N$10  (via drill 0.3 pad 0.61)
  Top 0.254: U1.2 27.02,13.32 v27.03,13.31
  Bottom 0.254: v27.03,13.31 R4.1
N$11
  Top 0.254: D39.3 17.64,37.22 R98.1
N$12
  Top 0.254: D39.2 19.39,39.29 20.68,38 20.68,37.13 R99.1
N$47  (via drill 0.3 pad 0.61)
  Top 0.305: v8.71,39.62 7.73,38.65 U$3.1 7.16,37.63 6.96,37.44 6.96,36.83 7.16,36.63 U$3.3
  Bottom 0.305: D14.C 8.69,39.6 v8.71,39.62
N$49  (via drill 0.3 pad 0.61)
  Top 0.305: LED2.A 9.66,33.39 v9.68,33.38
  Bottom 0.305: v9.68,33.38 R62.1
N$51  (via drill 0.3 pad 0.61)
  Top 0.305: U$3.6 10.43,37.63 v10.39,37.64
  Bottom 0.305: v10.39,37.64 8.89,37.64 C53.2
N$108
  Top 0.254: R97.1 14.4,37.34 15.34,38.28 15.88,38.28 D39.4
N$117
  Top 0.254: R97.2 12.88,36.3 U$4.3
N$122
  Top 0.254: R98.2 16,36.3 U$5.3
N$126
  Top 0.254: R99.2 19.13,36.3 U$6.3
NRST  (via drill 0.3 pad 0.61)
  Top 0.254: 14.38,25.55 v14.4,25.55 20.01,25.55 20.45,25.98 23.85,25.98 26.72,28.85 28.68,28.85 | U$2.7 12.13,22.34 v12.14,22.33 | 29.53,28.85 J2.5 | 28.68,28.85 29.53,28.85 | 28.68,28.85 S2.1 | C45.1 R43.1 29.46,28.79 29.53,28.85
  Bottom 0.254: v12.14,22.33 12.14,24.03 13.66,25.55 v14.4,25.55
OSC32_IN
  Top 0.254: C36.2 5.85,32.41 X5.1 7.91,30.35 R38.2 9.86,30.35 10.08,30.12 10.08,26.38 | 10.08,26.38 | 10.08,26.38 10.08,24.54 10.29,24.33 U$2.3
OSC32_OUT
  Top 0.254: C34.2 5.85,26.77 X5.4 7.91,28.83 R38.1 9.68,28.4 9.68,24.37 10.21,23.84 U$2.4
OSC_IN
  Top 0.254: Y1.1 5.59,20.55 C32.1 R37.1 7.75,18.77 8.05,19.07 8.05,21.92 9.45,23.32 10.99,23.32 U$2.5
OSC_OUT
  Top 0.254: Y1.2 5.64,15.52 C33.1 R37.2 7.75,17.25 8.46,17.96 8.46,21.75 9.55,22.84 U$2.6
RGB.B
  Top 0.254: U$2.61 14.51,30.11 12.72,31.9 12.72,33.31 U$4.1
RGB.G
  Top 0.254: U$2.59 15.51,33.04 U$5.1
RGB.R
  Top 0.254: U$2.58 16.01,29.94 18.94,32.87 U$6.1 18.94,32.97
SDIO.CD  (via drill 0.3 pad 0.61)
  Top 0.254: v19.15,22.05 20.95,22.05 21.16,21.84 U$2.41 24.4,21.84 25.59,20.65 R26.1
  Bottom 0.254: J4.SWA 15.11,33.82 15.11,24.13 17.2,22.05 v19.15,22.05
SDIO.CK  (via drill 0.3 pad 0.61)
  Top 0.254: v18.52,26.21 v18.51,26.21 U$2.53 18.51,29.27 20.71,31.46 22.72,31.46 23.98,32.72 R14.1
  Bottom 0.254: v18.52,26.21 20.19,26.21 21.34,25.07 J4.5
SDIO.CMD  (via drill 0.3 pad 0.61)
  Top 0.254: U$2.54 17.98,27.37 17.98,28.5 v17.88,28.55 18.11,28.78 18.11,29.43 20.54,31.87 21.46,31.87 22.38,32.78 R15.1
  Bottom 0.254: v17.88,28.55 19.81,26.62 21.97,26.62 23.52,25.07 23.52,24.34 J4.3
SDIO.D0  (via drill 0.3 pad 0.61)
  Top 0.254: v21.41,20.65 21.6,20.84 U$2.39 24.25,20.84 27.64,17.45 R19.1
  Bottom 0.254: v21.41,20.65 21.41,21.59 19.25,23.75 19.25,24.21 J4.7
SDIO.D1  (via drill 0.3 pad 0.61)
  Top 0.254: v20.78,21.34 20.73,21.34 U$2.40 22.59,21.27 24.4,21.27 26.61,19.05 R18.1
  Bottom 0.254: J4.8 18.03,24.08 v20.78,21.34
SDIO.D2  (via drill 0.3 pad 0.61)
  Top 0.254: U$2.51 19.51,28.07 v19.96,28.52 19.96,29.57 21.05,30.65 23.05,30.65 27.18,34.77 R17.1
  Bottom 0.254: v19.96,28.52 19.96,27.66 20.19,27.43 23.37,27.43 25.73,25.07 J4.1
SDIO.D3  (via drill 0.3 pad 0.61)
  Top 0.254: U$2.52 19.01,28.41 v19.15,28.55 19.15,29.33 20.88,31.06 22.89,31.06 25.58,33.75 R16.1
  Bottom 0.254: v19.15,28.55 19.15,27.85 19.98,27.03 22.68,27.03 24.64,25.07 24.64,24.34 J4.2
SWCLK
  Top 0.254: 20.51,27.53 U$2.49 20.6,27.43 20.6,29.13 21.72,30.24 23.22,30.24 27.36,34.38 29.73,34.38 J2.2
SWDIO
  Top 0.254: J2.4 33.12,30.1 33.12,25.65 31.81,24.34 U$2.46
USART1.RX
  Top 0.254: U$2.43 30.86,22.84 J1.9
USART1.TX
  Top 0.254: U$2.42 29.12,22.34 31.75,19.71 J1.8
USART2.RX  (via drill 0.3 pad 0.61)
  Top 0.254: U$2.17 13.01,16.23 v12.01,16.23
  Bottom 0.254: R3.2 25.38,11.33 18.12,11.33 13.22,16.23 v12.01,16.23
USART2.TX  (via drill 0.3 pad 0.61)
  Top 0.305: U$2.16 12.13,17.84 v12.14,17.88
  Bottom 0.254: R4.2 23.98,13.03 16.99,13.03 v12.14,17.88
USART3.RX  (via drill 0.3 pad 0.61)
  Top 0.254: U$2.25 v17.01,14.74 v17.02,14.73
  Bottom 0.254: v17.02,14.73 18.77,14.73 19.46,14.05 19.91,14.05 20.6,14.73 27.14,14.73 29.26,12.61 29.26,12.26 | J1.3 31.34,6.71 29.26,8.79 29.26,12.26 | 29.26,12.26
USART3.TX  (via drill 0.3 pad 0.61)
  Top 0.254: U$2.29 19.01,13.88 v18.85,13.72
  Bottom 0.254: v18.85,13.72 18.92,13.64 20.08,13.64 20.77,14.33 26.95,14.33 28.85,12.43 28.85,6.68 31.37,4.17 J1.2
USART6.RX
  Top 0.254: U$2.38 24.18,20.34 25.27,19.24 25.27,18.39 27.08,16.59 29.57,16.59 J1.6
USART6.TX
  Top 0.254: J1.5 31.83,12.6 30.61,13.82 30.61,14.97 29.4,16.18 26.91,16.18 24.88,18.2 | 24.88,18.2 | U$2.37 24.1,19.84 24.87,19.07 24.87,18.22 24.88,18.2 | 24.88,18.2
VBAT  (via drill 0.3 pad 0.61)
  Top 0.305: U$2.1 11.01,26.35 v11,26.36 | 11.86,15.14 v11.84,15.16 11.84,14.91 12.09,14.66 12.09,14.15 12.37,13.87 13.04,13.87 13.09,13.92 SVBAT.2
  Bottom 0.305: C47.1 v11,26.36 11,16.03 v11.84,15.16
VCAP_1  (via drill 0.3 pad 0.61)
  Top 0.254: U$2.30 19.51,14.9 v19.68,14.73
  Bottom 0.254: C51.1 21.1,16.15 v19.68,14.73
VDDA  (via drill 0.3 pad 0.61)
  Top 0.305: U$2.13 10.02,19.34 v9.37,18.69
  Bottom 0.305: C46.1 L1.2 v9.37,18.69
VIN3V3  (via drill 0.3 pad 0.61)
  Top 0.305: 10.43,36.63 U$3.4 | 10.43,36.63 v10.39,36.63 | 10.57,36.63 10.43,36.63 | v9.55,11.05 10.46,10.13 13.41,10.13 14.38,9.17 14.38,6.49 S3.3V.1
  Bottom 0.305: C54.2 | C54.2 C57.2 1.47,30.94 1.47,13.95 4.37,11.05 v9.55,11.05 | v10.39,36.63 10.12,36.63 9.16,35.67 7.8,35.67 C54.2
VIN5V  (via drill 0.3 pad 0.61)
  Top 0.305: S5V.1 6.9,10.07 v6.88,10.08
  Bottom 0.305: D14.A 5.41,39.49 C56.2 C55.2 3.81,36.5 X20.1 1.02,33.71 1.02,13.63 1.14,13.63 4.69,10.08 v6.88,10.08

### Text on the board
tStop: /home/duver/Documents/other/logo vettoriale.bmp